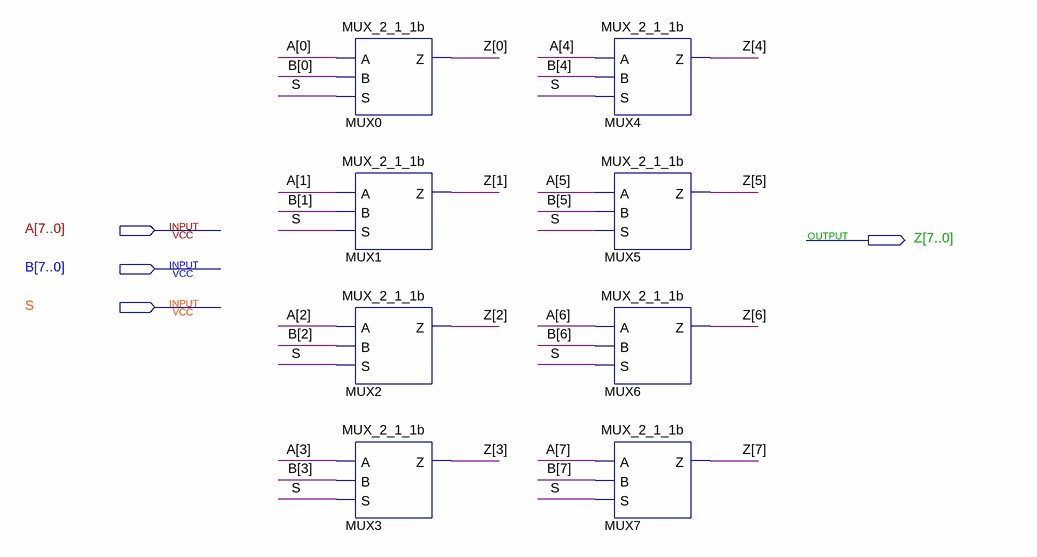
[diagram p0: schematic sheet]
// Quartus schematic MUX_2_1.bdf as structural Verilog: 8 symbols, 4 pins
module MUX_2_1 (
  input  [7:0] A,
  input  [7:0] B,
  input  S,
  output [7:0] Z
);

  MUX_2_1_1b MUX0 (.A(A[0]), .B(B[0]), .S(S), .Z(Z[0]));
  MUX_2_1_1b MUX1 (.A(A[1]), .B(B[1]), .S(S), .Z(Z[1]));
  MUX_2_1_1b MUX2 (.A(A[2]), .B(B[2]), .S(S), .Z(Z[2]));
  MUX_2_1_1b MUX3 (.A(A[3]), .B(B[3]), .S(S), .Z(Z[3]));
  MUX_2_1_1b MUX4 (.A(A[4]), .B(B[4]), .S(S), .Z(Z[4]));
  MUX_2_1_1b MUX5 (.A(A[5]), .B(B[5]), .S(S), .Z(Z[5]));
  MUX_2_1_1b MUX6 (.A(A[6]), .B(B[6]), .S(S), .Z(Z[6]));
  MUX_2_1_1b MUX7 (.A(A[7]), .B(B[7]), .S(S), .Z(Z[7]));
endmodule
